# Altium schematic sheet SbusConverter_v2.SchDoc
size 431 x 279 mm; SheetNumber: 1; SheetTotal: 1
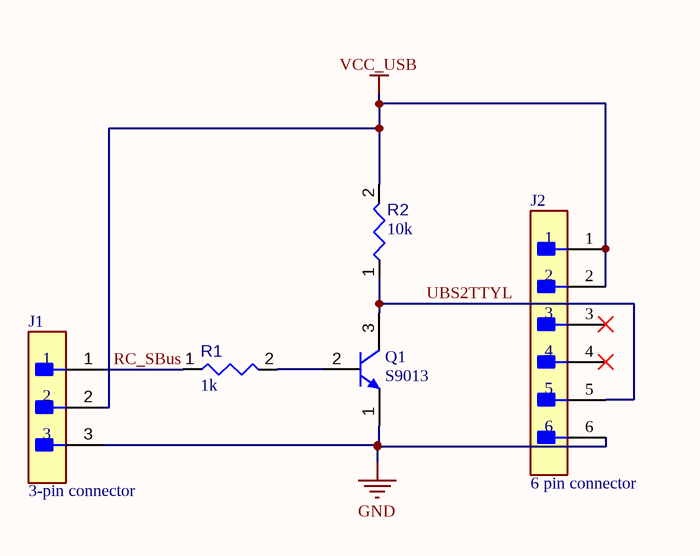
[diagram p0: SbusConverter_v2.SchDoc]

## Parts
J1  3-pin connector  [FP-87224-3-MFG]
J2  6 pin connector  [FP-HTSW-106-07-G-S-MFG]
Q1  S9013  [JSCJ-TO-92-3_V]
R1  value 1k  [RESA60-630X240]  (hidden comment: MFR-25FBF52-1K)
R2  value 10k  [RESA60-630X240]  (hidden comment: MFR-25FBF52-10K)

## Nets
GND: J1.3 J2.6 Q1.1(E)
VCC_USB: J1.2 J2.1 J2.2 R2.2
RC_SBus: J1.1 R1.1
UBS2TTYL: J2.5 Q1.3(C) R2.1
NetQ1_2: Q1.2(B) R1.2

Not connected (* = marked no-connect by the designer): J2 3* 4*

## Notes on the sheet
- DWG. NO.
- REV.
- SHT.
- THIS DOCUMENT AND THE DATA DISCLOSED HEREIN OR HEREWITH IS THE PROPERTY OF ALTIUM LIMITED AND MAY BE FREELY DISTRIBUTED IN WHOLE. NO RIGHTS ARE RESERVED OR EXPRESS OR IMPLIED WARANTEE GIVEN.
- REVISION
- DESCRIPTION
- DATE
- APPROVED
- ENG:
- APPROVALS
- PROJECT
- DSN:
- CHK:
- REFERENCE DOCUMENTS
- PROJECT REVISION:
- TITLE
- DOCUMENT REVISION:
- DESIGN ITEM:
- BOM:
- FAB DWG:
- PCB DWG:
- ASSY DWG:
- SCALE:
- SIZE
- B
- CAGE CODE
- FILE NAME
- DWG NO.
- SHEET
- OF
- REV

## Library data of the parts
J1 = CMP-002-00073-1: Board Connector, 3 Contact(s), 1 Row(s), Male, Straight, 0.1 inch Pitch, Solder Terminal, Black Insulator, Receptacle; IEC Conformance: No; Contact Style: SQ PIN-SKT; PCB Contact Pattern: RECTANGULAR; Number Of Connectors: 1; Reference Standard: UL; Mating Information: MULTIPLE MATING PARTS AVAILABLE; Option: General Purpose; Plating Thickness: 15uin; Body Length: 0.284inch; Rated Current (Signal): 3A; Body Depth: 0.09inch; Number of Contacts: 3; Insulation Resistance: 5GR; Reliability: COMMERCIAL; Dielectric Withstanding Voltage (AC): 750V; Contact Material: Copper Alloy; Insulation Material: Thermoplastic; Terminal Pitch: 2.54mm; Body Breadth: 0.1inch; Connector Type: BOARD CONNECTOR; Insulation Color: Black; Body/Shell Style: RECEPTACLE; Contact Gender: Male; MIL Conformance: No; Reach SVHC Compliant: No; Mating Contact Pitch: 0.1inch; Contact Finish - Termination: Gold (Au) - with Nickel (Ni) barrier; Min Operating Temperature: -65°C; Mounting Technology: Board; Termination: Solder; Filter Feature: No; JESD-609 Code: e4; Contact Finish - Mating: GOLD (15); Max Operating Temperature: 105°C; Number Of PCB Rows: 3; Terminal Length: 0.125inch; Contact Pattern: RECTANGULAR; Mounting Style: STRAIGHT; DIN Conformance: No; Number of Rows Loaded: 1; Mixed Contacts: No; RoHS Compliant: Yes; Flammability Rating: UL94 V-0
J2 = CMP-002-00076-1: Board Connector, 6 Contact(s), 1 Row(s), Male, Straight, 0.1 inch Pitch, Solder Terminal, Natural Insulator; Body Length: 1.2inch; PCB Contact Pattern: RECTANGULAR; Additional Feature: E.L.P.; IEC Conformance: No; Option: General Purpose; Body/Shell Style: RECEPTACLE; Number Of Connectors: 1; Number of Contacts: 6; Reference Standard: UL; Mating Information: MULTIPLE MATING PARTS AVAILABLE; Body Breadth: 0.198inch; Plating Thickness: 10uin; Contact Style: SQ PIN-SKT; Reliability: COMMERCIAL; Reach SVHC Compliant: Yes; Filter Feature: No; Contact Pattern: RECTANGULAR; Mating Contact Pitch: 0.1inch; JESD-609 Code: e4; Insulation Material: Polymer; Contact Gender: Male; Connector Type: BOARD CONNECTOR; Mixed Contacts: No; Mounting Style: STRAIGHT; RoHS Compliant: Yes; Insulation Color: Natural; Termination: Solder; Number Of PCB Rows: 1; Body Depth: 0.1inch; Terminal Pitch: 2.54mm; Number of Rows Loaded: 1; Max Operating Temperature: 125°C; Contact Material: Bronze; Mounting Technology: Board; Contact Finish - Termination: Gold (Au) - with Nickel (Ni) barrier; DIN Conformance: No; MIL Conformance: No; Contact Finish - Mating: GOLD (10) OVER NICKEL (50); Min Operating Temperature: -55°C
Q1 = CMP-013-00000-3: Transistor, NPN, 0.1 uA, 150 MHz, 3-Pin TO-92; Manufacturer: Jiangsu Changjiang Electronics Technology; Case/Package: TO-92-3; Datasheet URL: http://www.cj-elec.com/txUpfile/20121910315050632.pdf; Datasheet Version: Rev. B, 11/2011; Package Description: 3-Pin Through Hole Device, Height 4.7 mm, Pitch 2.3 mm; Mounting Technology: TH; RoHS Compliant: False; Package Reference: TO-92-3
R1 = CMP-009-00048-4: Axial Resistor, 1 KOhm, +/- 1%, 250 mW, -55 to 155 degC, 2-Pin THD, RoHS, Bulk; Manufacturer: Yageo; Voltage Rating: 250V; Power: 250mW; Min Operating Temperature: -55°C; Max Operating Temperature: 155°C; Tolerance: 1%; Package Reference: MFR-25; Composition: CarbonFilm; Mounting Technology: TH; Packaging: Bulk; Case/Package: Axial; Datasheet URL: http://www.yageo.com/documents/recent/Yageo%20LR_MFR_2013.pdf; Package Quantity: 200; Manufacturer URL: http://www.yageo.com/; Package Description: 2-Pin Axial Lead, Dia 2.4 mm, Body Length 6.3 mm; Datasheet Version: Apr-13; RoHS Compliant: True
R2 = CMP-009-00047-4: Axial Resistor, 10 KOhm, +/- 1%, 0.25 W, -55 to 155 degC, 2-Pin THD, RoHS, Bulk; Manufacturer: Yageo; Power: 250mW; Voltage Rating: 250V; Manufacturer URL: http://www.yageo.com/; Datasheet URL: http://www.yageo.com/documents/recent/Yageo%20LR_MFR_2013.pdf; Package Reference: MFR-25; Min Operating Temperature: -55°C; Mounting Technology: TH; Package Quantity: 200; Case/Package: Axial; Tolerance: 1%; RoHS Compliant: True; Datasheet Version: Apr-13; Packaging: Bulk; Max Operating Temperature: 155°C; Package Description: 2-Pin Axial Lead, Dia 2.4 mm, Body Length 6.3 mm